# Altium schematic sheet CortexM3_dev.SchDoc: Cortex M3 Dev and Memory
size A4; DrawnBy: Watzek; Organization: HTL Hollabrunn; Address1: Abteilung Elektronik; Address2: Anton Ehrenfried-Straße 10; Address3: 2020 Hollabrunn; DocumentNumber: 06; Revision: 01; SheetNumber: 06; SheetTotal: 12; SPICEModelCacheGTJPSRCJ: <root> / <DocumentId>GTJPSRCJ</DocumentId> / <CacheFrame Number="0"> / <Model Name="led0" Kind="MDL"> / <Text>*Typ INFRARED GaAs LED: Vf=1.2V Vr=5V If=40mA trr=3uS / *LED Pinout: 1=A, 2=K / .MODEL LED0 D (IS=93.5P RS=84M N=2.63 BV=5 IBV=10U / + CJO=2.97P VJ=.75 M=.333 TT=4.32U)</Text> / </Model> / </CacheFrame> / </root>
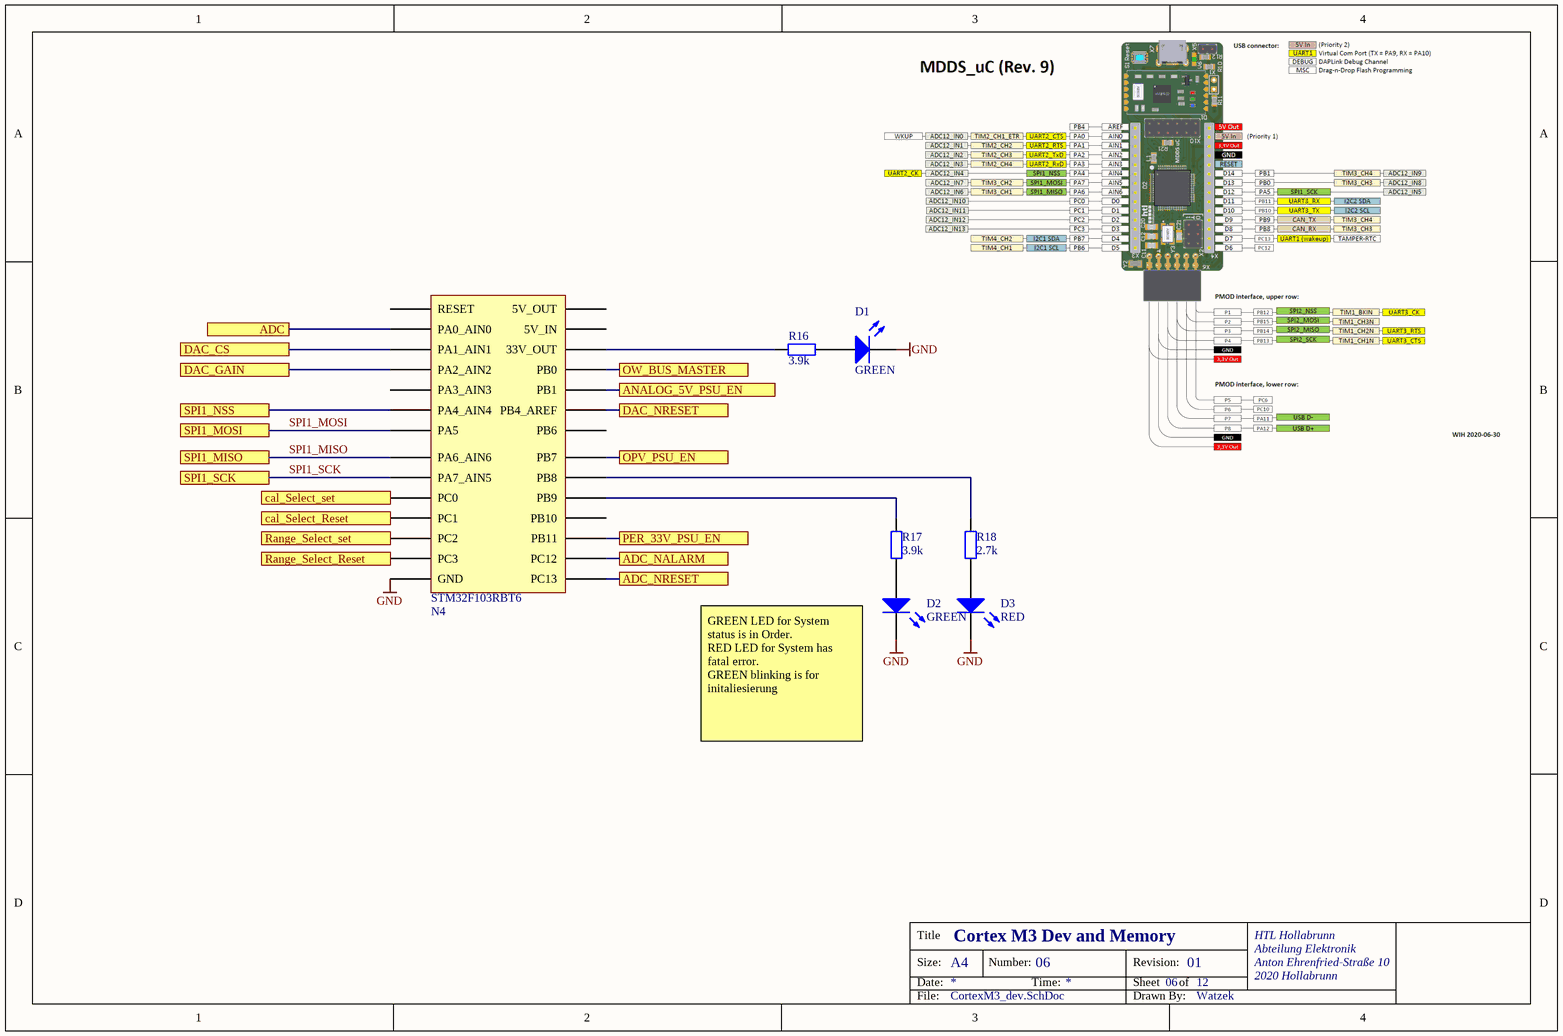
[diagram p0: CortexM3_dev.SchDoc]

## Parts
D1  GREEN  [6-0805_N-KUE]
D2  GREEN  [6-0805_N-KUE]
D3  RED  [6-0805_N-KUE]
N4  STM32F103  [DIP28]  (value not drawn)
R16  3.9k  [C1206-KUE]
R17  3.9k  [C1206-KUE]
R18  2.7k  [C1206-KUE]

## Ports
ADC, ADC_NALARM, ADC_NRESET, ANALOG_5V_PSU_EN, cal_Select_Reset, cal_Select_set, DAC_CS, DAC_GAIN, DAC_NRESET, OPV_PSU_EN, OW_BUS_MASTER, PER_33V_PSU_EN, Range_Select_Reset, Range_Select_set, SPI1_MISO, SPI1_MOSI, SPI1_NSS, SPI1_SCK

## Nets
GND: D1.2(K) D2.2(K) D3.2(K) N4.18(GND)
ADC: N4.2(PA0_AIN0) ; port ADC
ADC_NALARM: N4.28(PC12) ; port ADC_NALARM
ADC_NRESET: N4.27(PC13) ; port ADC_NRESET
ANALOG_5V_PSU_EN: N4.20(PB1) ; port ANALOG_5V_PSU_EN
cal_Select_Reset: N4.10(PC1) ; port cal_Select_Reset
cal_Select_set: N4.9(PC0) ; port cal_Select_set
DAC_CS: N4.3(PA1_AIN1) ; port DAC_CS
DAC_GAIN: N4.4(PA2_AIN2) ; port DAC_GAIN
DAC_NRESET: N4.1(PB4_AREF) ; port DAC_NRESET
OPV_PSU_EN: N4.13(PB7) ; port OPV_PSU_EN
OW_BUS_MASTER: N4.21(PB0) ; port OW_BUS_MASTER
PER_33V_PSU_EN: N4.23(PB11) ; port PER_33V_PSU_EN
Range_Select_Reset: N4.12(PC3) ; port Range_Select_Reset
Range_Select_set: N4.11(PC2) ; port Range_Select_set
SPI1_MISO: N4.8(PA6_AIN6) ; port SPI1_MISO
SPI1_MOSI: N4.22(PA5) ; port SPI1_MOSI
SPI1_NSS: N4.6(PA4_AIN4) ; port SPI1_NSS
SPI1_SCK: N4.7(PA7_AIN5) ; port SPI1_SCK
NetD1_1: D1.1(A) R16.2
NetD2_1: D2.1(A) R17.2
NetD3_1: D3.1(A) R18.2
NetN4_17: N4.17(33V_OUT) R16.1
NetN4_25: N4.25(PB9) R17.1
NetN4_26: N4.26(PB8) R18.1

Not connected (* = marked no-connect by the designer): N4 5(PA3_AIN3) 14(PB6) 15(5V_OUT) 16(5V_IN) 19(RESET) 24(PB10)

## Notes on the sheet
- (near D2) GREEN LED for System status is in Order.
  RED LED for System has fatal error.
  GREEN blinking is for initaliesierung
- Title
- Size:
- Date:
- A4
- Number:
- Time:
- Revision:
- Sheet
- of
- HTL Hollabrunn
- Abteilung Elektronik
- Anton Ehrenfried-Straße 10
- 2020 Hollabrunn
- File:
- Drawn By:
- (in symbol STM32F103) STM32F103RBT6

## Library data of the parts
D1-D3 = LED0: Typical INFRARED GaAs LED; Published: 8-Jun-2000; LatestRevisionDate: 08-Jul-2005; LatestRevisionNote: Mech Layer 1 removed.; PackageReference: LED-0; Publisher: Altium Limited; PackageDescription: LED; 2 Leads
R16-R18 = ResistorSMD: Resistor SMD; Manufacturer: AVX; Bezeichnung: SMD Wid. 1/8W 2%; Published: 8-Jun-2000; LatestRevisionDate: 17-Jul-2002; LatestRevisionNote: Re-released for DXP Platform.; PackageReference: AXIAL-0.4; Publisher: Altium Limited; PackageDescription: Axial Device, Thru-Hole; 2 Leads; 0.4 in Pin Spacing; Orderingcode: *
  R16 R17: Value: 3.9k
  R18: Value: 2.7k